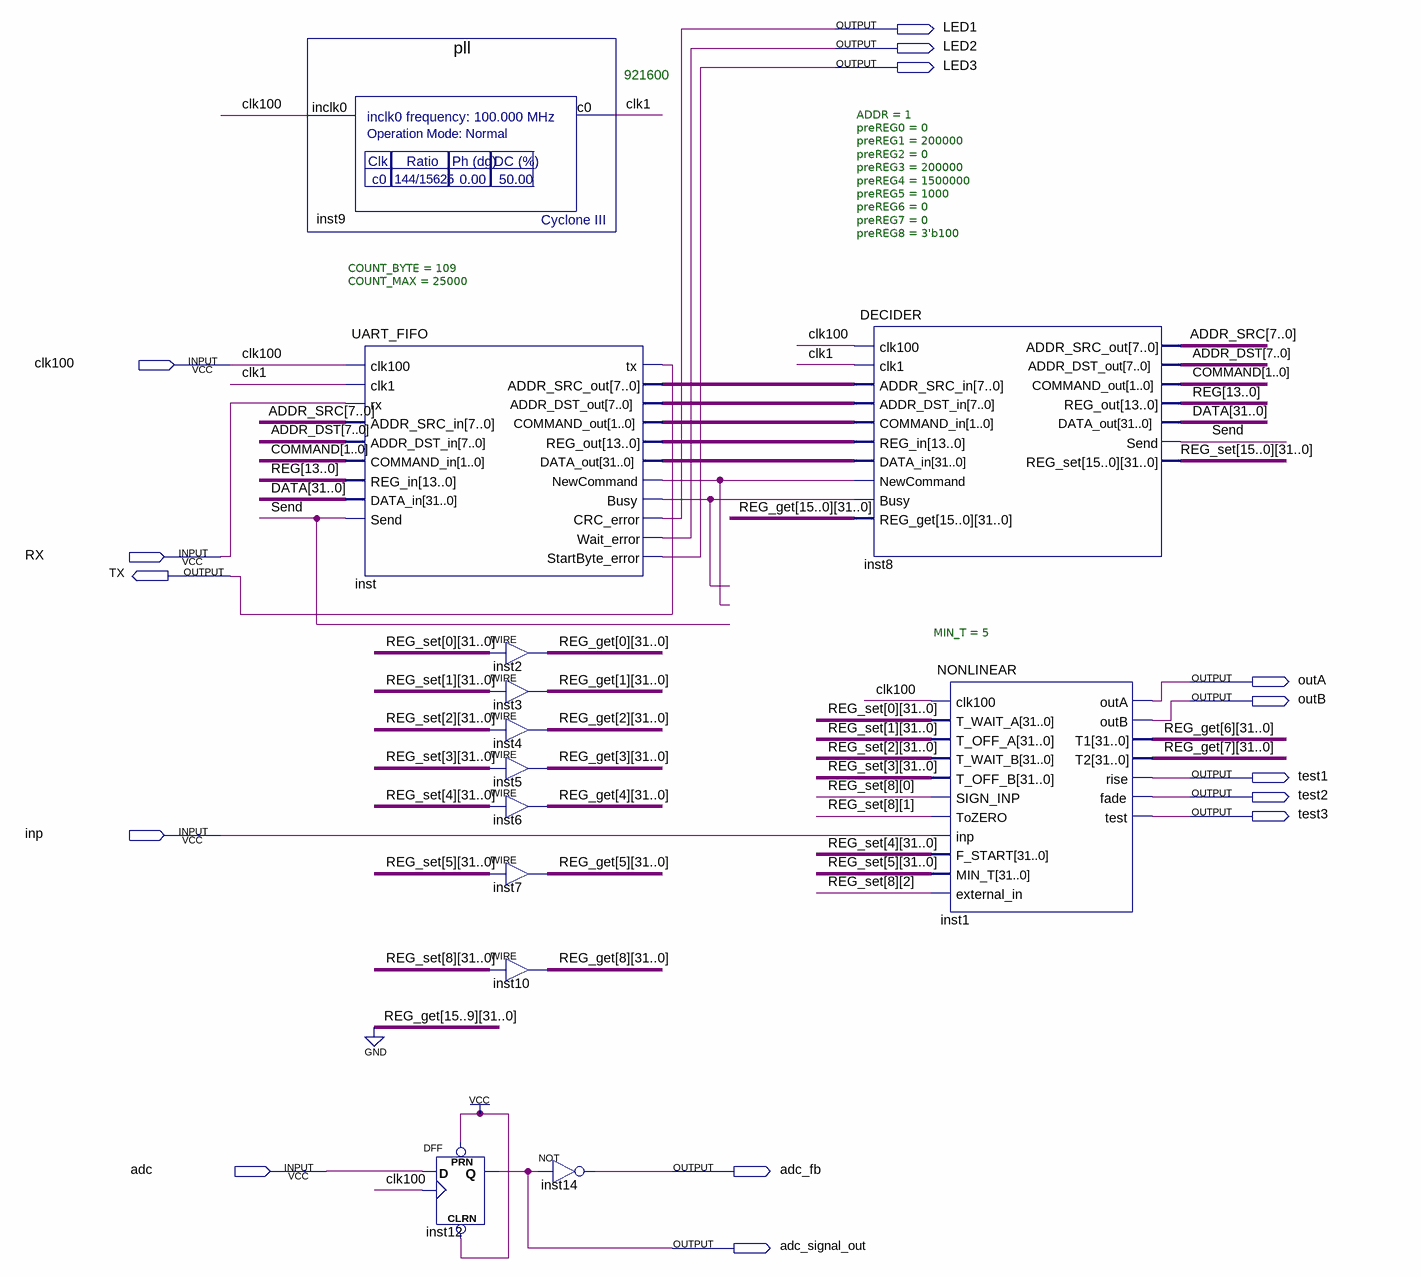
[diagram p0: schematic sheet]
// Quartus schematic FPGA_MEMS_Maket.bdf as structural Verilog: 13 symbols, 15 pins
module FPGA_MEMS_Maket (
  input  clk100,
  input  RX,
  input  inp,
  input  adc,
  output LED1,
  output LED2,
  output LED3,
  output TX,
  output outA,
  output outB,
  output test1,
  output test2,
  output test3,
  output adc_fb,
  output adc_signal_out
);

  wire clk1, inst_busy, inst_newcommand, Send;
  wire [1:0] COMMAND, inst_command_out;
  wire [7:0] ADDR_DST, ADDR_SRC, inst_addr_dst_out, inst_addr_src_out;
  wire [13:0] inst_reg_out, REG;
  wire [31:0] DATA, inst_data_out, REG_get_0, REG_get_1, REG_get_2, REG_get_3, REG_get_4, REG_get_5,
       REG_get_6, REG_get_7, REG_get_8, REG_set_0, REG_set_1, REG_set_2, REG_set_3, REG_set_4, REG_set_5,
       REG_set_6, REG_set_7, REG_set_8, REG_set_9, REG_set_10, REG_set_11, REG_set_12, REG_set_13,
       REG_set_14, REG_set_15;

  pll inst9 (.inclk0(clk100), .c0(clk1));
  UART_FIFO #(.COUNT_BYTE(109), .COUNT_MAX(25000)) inst (
    .clk100(clk100), .clk1(clk1), .rx(RX), .ADDR_SRC_in(ADDR_SRC), .ADDR_DST_in(ADDR_DST),
    .COMMAND_in(COMMAND), .REG_in(REG), .DATA_in(DATA), .Send(Send), .tx(TX),
    .ADDR_SRC_out(inst_addr_src_out), .ADDR_DST_out(inst_addr_dst_out), .COMMAND_out(inst_command_out),
    .REG_out(inst_reg_out), .DATA_out(inst_data_out), .NewCommand(inst_newcommand), .Busy(inst_busy),
    .CRC_error(LED1), .Wait_error(LED2), .StartByte_error(LED3));
  assign REG_get_0 = REG_set_0;  // WIRE inst2
  assign REG_get_1 = REG_set_1;  // WIRE inst3
  assign REG_get_2 = REG_set_2;  // WIRE inst4
  assign REG_get_3 = REG_set_3;  // WIRE inst5
  assign REG_get_4 = REG_set_4;  // WIRE inst6
  assign REG_get_5 = REG_set_5;  // WIRE inst7
  assign REG_get_8 = REG_set_8;  // WIRE inst10
  DFF inst12 (.CLRN(1'b1), .CLK(clk100), .D(adc), .PRN(1'b1), .Q(adc_signal_out));
  not inst14 (adc_fb, adc_signal_out);
  DECIDER #(.ADDR(1), .preREG0(0), .preREG1(200000), .preREG2(0), .preREG3(200000), .preREG4(1500000), .preREG5(1000), .preREG6(0), .preREG7(0), .preREG8(3'b100)) inst8 (
    .clk100(clk100), .clk1(clk1), .ADDR_SRC_in(inst_addr_src_out), .ADDR_DST_in(inst_addr_dst_out),
    .COMMAND_in(inst_command_out), .REG_in(inst_reg_out), .DATA_in(inst_data_out),
    .NewCommand(inst_newcommand), .Busy(inst_busy),
    .REG_get({{224{1'b0}}, REG_get_8, REG_get_7, REG_get_6, REG_get_5, REG_get_4, REG_get_3, REG_get_2, REG_get_1, REG_get_0}),
    .ADDR_SRC_out(ADDR_SRC), .ADDR_DST_out(ADDR_DST), .COMMAND_out(COMMAND), .REG_out(REG), .DATA_out(DATA),
    .Send(Send),
    .REG_set({REG_set_15, REG_set_14, REG_set_13, REG_set_12, REG_set_11, REG_set_10, REG_set_9, REG_set_8, REG_set_7, REG_set_6, REG_set_5, REG_set_4, REG_set_3, REG_set_2, REG_set_1, REG_set_0}));
  NONLINEAR #(.MIN_T(5)) inst1 (
    .clk100(clk100), .T_WAIT_A(REG_set_0), .T_OFF_A(REG_set_1), .T_WAIT_B(REG_set_2), .T_OFF_B(REG_set_3),
    .SIGN_INP(REG_set_8[0]), .ToZERO(REG_set_8[1]), .inp(inp), .F_START(REG_set_4), .MIN_T(REG_set_5),
    .external_in(REG_set_8[2]), .outA(outA), .outB(outB), .T1(REG_get_6), .T2(REG_get_7), .rise(test1),
    .fade(test2), .test(test3));

  // Notes on the sheet:
  //   921600
endmodule
